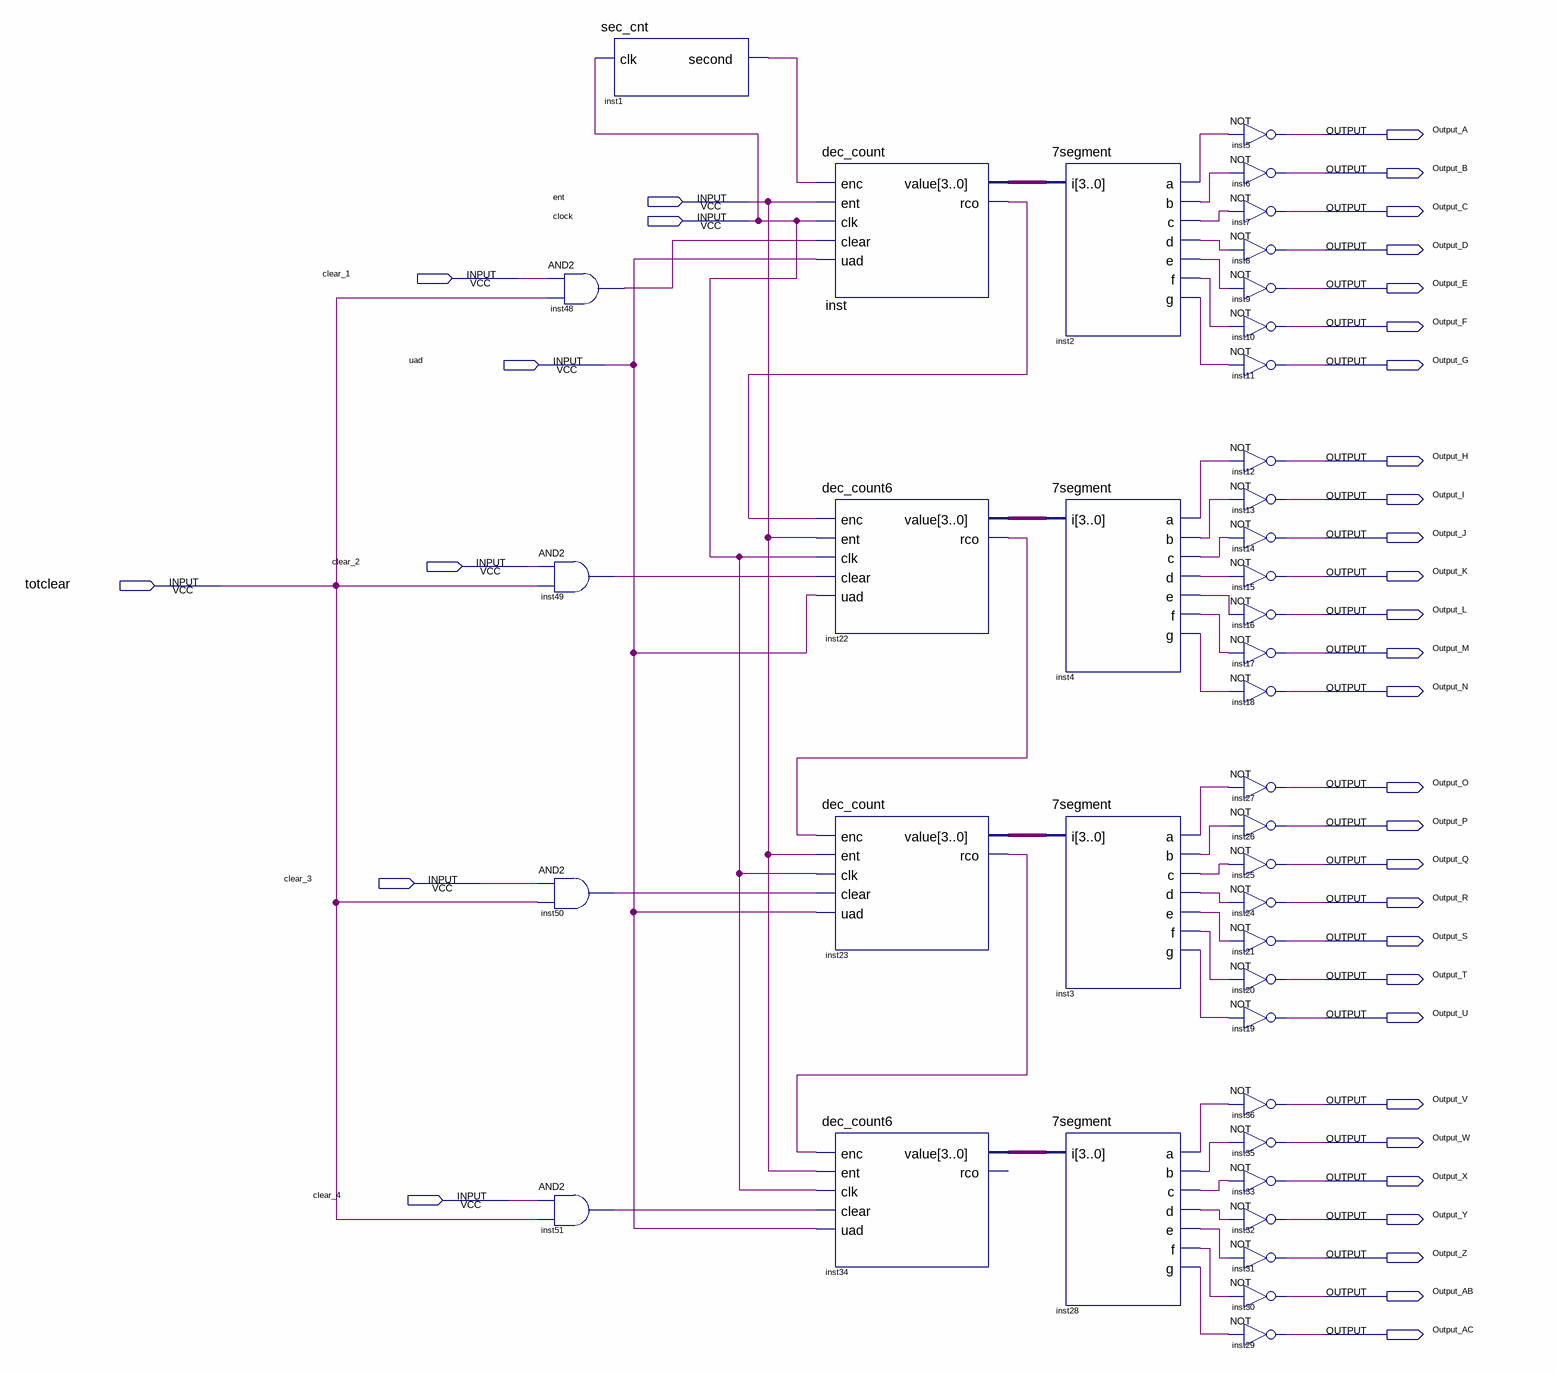
[diagram p0: schematic sheet]
// Quartus schematic Counter.bdf as structural Verilog: 41 symbols, 36 pins
module Counter (
  input  ent,
  input  clock,
  input  clear_1,
  input  uad,
  input  clear_2,
  input  totclear,
  input  clear_3,
  input  clear_4,
  output Output_A,
  output Output_B,
  output Output_C,
  output Output_D,
  output Output_E,
  output Output_F,
  output Output_G,
  output Output_H,
  output Output_I,
  output Output_J,
  output Output_K,
  output Output_L,
  output Output_M,
  output Output_N,
  output Output_O,
  output Output_P,
  output Output_Q,
  output Output_R,
  output Output_S,
  output Output_T,
  output Output_U,
  output Output_V,
  output Output_W,
  output Output_X,
  output Output_Y,
  output Output_Z,
  output Output_AB,
  output Output_AC
);

  wire inst1_second, inst2_a, inst2_b, inst2_c, inst2_d, inst2_e, inst2_f, inst2_g, inst3_a, inst3_b,
       inst3_c, inst3_d, inst3_e, inst3_f, inst3_g, inst4_a, inst4_b, inst4_c, inst4_d, inst4_e, inst4_f,
       inst4_g, inst22_rco, inst23_rco, inst28_a, inst28_b, inst28_c, inst28_d, inst28_e, inst28_f, inst28_g,
       inst48_out, inst49_out, inst50_out, inst51_out, inst_rco;
  wire [3:0] inst22_value, inst23_value, inst34_value, inst_value;

  and inst48 (inst48_out, clear_1, totclear);
  and inst49 (inst49_out, clear_2, totclear);
  and inst50 (inst50_out, clear_3, totclear);
  and inst51 (inst51_out, clear_4, totclear);
  sec_cnt inst1 (.clk(clock), .second(inst1_second));
  dec_count inst (
    .enc(inst1_second), .ent(ent), .clk(clock), .clear(inst48_out), .uad(uad), .value(inst_value),
    .rco(inst_rco));
  dec_count6 inst22 (
    .enc(inst_rco), .ent(ent), .clk(clock), .clear(inst49_out), .uad(uad), .value(inst22_value),
    .rco(inst22_rco));
  dec_count inst23 (
    .enc(inst22_rco), .ent(ent), .clk(clock), .clear(inst50_out), .uad(uad), .value(inst23_value),
    .rco(inst23_rco));
  dec_count6 inst34 (
    .enc(inst23_rco), .ent(ent), .clk(clock), .clear(inst51_out), .uad(uad), .value(inst34_value));  // open: rco
  \7segment  inst2 (
    .i(inst_value), .a(inst2_a), .b(inst2_b), .c(inst2_c), .d(inst2_d), .e(inst2_e), .f(inst2_f), .g(inst2_g));
  \7segment  inst4 (
    .i(inst22_value), .a(inst4_a), .b(inst4_b), .c(inst4_c), .d(inst4_d), .e(inst4_e), .f(inst4_f),
    .g(inst4_g));
  \7segment  inst3 (
    .i(inst23_value), .a(inst3_a), .b(inst3_b), .c(inst3_c), .d(inst3_d), .e(inst3_e), .f(inst3_f),
    .g(inst3_g));
  \7segment  inst28 (
    .i(inst34_value), .a(inst28_a), .b(inst28_b), .c(inst28_c), .d(inst28_d), .e(inst28_e), .f(inst28_f),
    .g(inst28_g));
  not inst5 (Output_A, inst2_a);
  not inst6 (Output_B, inst2_b);
  not inst7 (Output_C, inst2_c);
  not inst8 (Output_D, inst2_d);
  not inst9 (Output_E, inst2_e);
  not inst10 (Output_F, inst2_f);
  not inst11 (Output_G, inst2_g);
  not inst12 (Output_H, inst4_a);
  not inst13 (Output_I, inst4_b);
  not inst14 (Output_J, inst4_c);
  not inst15 (Output_K, inst4_d);
  not inst16 (Output_L, inst4_e);
  not inst17 (Output_M, inst4_f);
  not inst18 (Output_N, inst4_g);
  not inst27 (Output_O, inst3_a);
  not inst26 (Output_P, inst3_b);
  not inst25 (Output_Q, inst3_c);
  not inst24 (Output_R, inst3_d);
  not inst21 (Output_S, inst3_e);
  not inst20 (Output_T, inst3_f);
  not inst19 (Output_U, inst3_g);
  not inst36 (Output_V, inst28_a);
  not inst35 (Output_W, inst28_b);
  not inst33 (Output_X, inst28_c);
  not inst32 (Output_Y, inst28_d);
  not inst31 (Output_Z, inst28_e);
  not inst30 (Output_AB, inst28_f);
  not inst29 (Output_AC, inst28_g);
endmodule
